# Altium schematic sheet optics.SchDoc
size A4; SheetNumber: 5; SheetTotal: 6
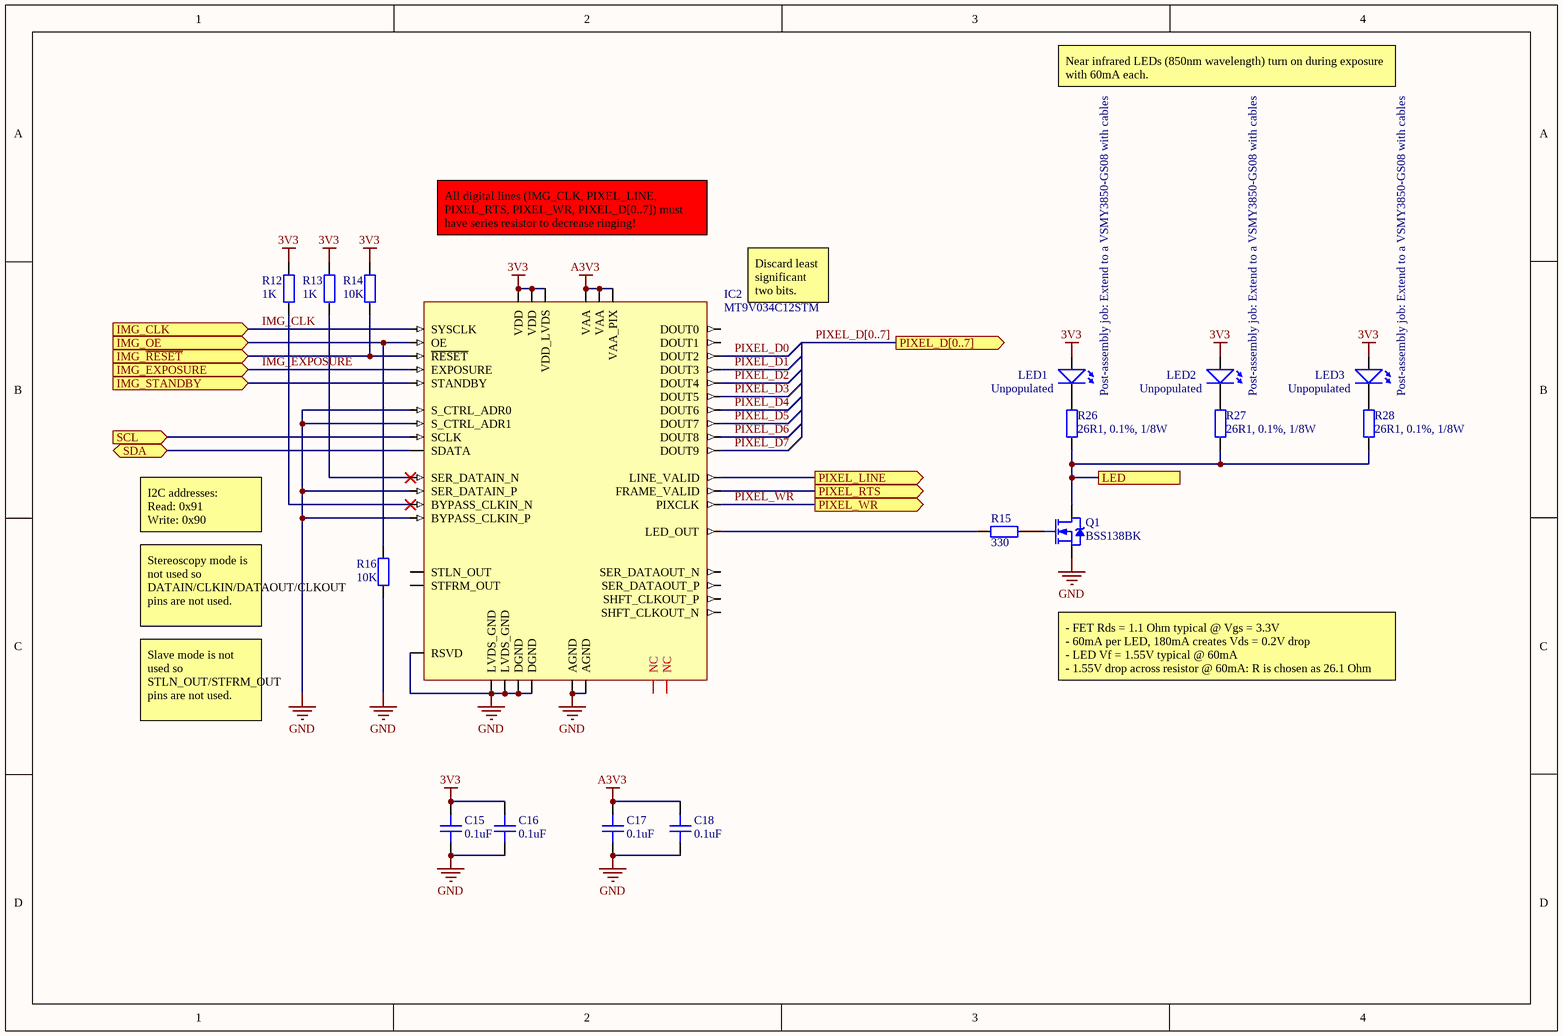
[diagram p0: optics.SchDoc]

## Parts
C15  0.1uF  [1608[0603]_M]
C16  0.1uF  [1608[0603]_M]
C17  0.1uF  [1608[0603]_M]
C18  0.1uF  [1608[0603]_M]
IC2  MT9V034C12STM  [CLCC-48_m]
LED1  Unpopulated  Post-assembly job: Extend to a VSMY3850-GS08 with cables  [CABLE-TERMINAL1x2]
LED2  Unpopulated  Post-assembly job: Extend to a VSMY3850-GS08 with cables  [CABLE-TERMINAL1x2]
LED3  Unpopulated  Post-assembly job: Extend to a VSMY3850-GS08 with cables  [CABLE-TERMINAL1x2]
Q1  BSS138BK  [SOT23-3_N]
R12  1K  [1608[0603]_M]
R13  1K  [1608[0603]_M]
R14  10K  [1608[0603]_M]
R15  330  [1608[0603]_M]
R16  10K  [1608[0603]_M]
R26  26R1, 0.1%, 1/8W  [2012[0805]_M]
R27  26R1, 0.1%, 1/8W  [2012[0805]_M]
R28  26R1, 0.1%, 1/8W  [2012[0805]_M]

## Ports
IMG_CLK (in), IMG_EXPOSURE (in), IMG_OE (in), IMG_STANDBY (in), IMG_~{RESET} (in), LED, PIXEL_D[0..7] (out), PIXEL_LINE (out), PIXEL_RTS (out), PIXEL_WR (out), SCL (in), SDA (bidir)

## Nets
3V3: C15.2 C16.2 IC2.1(VDD) IC2.6(VDD_LVDS) IC2.14(VDD) LED1.A LED2.A LED3.A R12.2 R13.2 R14.2
A3V3: C17.2 C18.2 IC2.35(VAA) IC2.39(VAA) IC2.40(VAA_PIX)
GND: C15.1 C16.1 C17.1 C18.1 IC2.7(LVDS_GND) IC2.9(BYPASS_CLKIN_P) IC2.11(SER_DATAIN_P) IC2.12(LVDS_GND) IC2.13(DGND) IC2.29(RSVD) IC2.30(S_CTRL_ADR0) IC2.31(S_CTRL_ADR1) IC2.34(AGND) IC2.38(AGND) IC2.48(DGND) Q1.S R16.1
IMG_CLK: IC2.47(SYSCLK) ; port IMG_CLK
IMG_EXPOSURE: IC2.23(EXPOSURE) ; port IMG_EXPOSURE
IMG_OE: IC2.28(OE) R16.2 ; port IMG_OE
IMG_~{RESET}: IC2.32(~{RESET}) R14.1 ; port IMG_~{RESET}
IMG_STANDBY: IC2.33(STANDBY) ; port IMG_STANDBY
LED: Q1.D R26.1 R27.1 R28.1 ; port LED
PIXEL_D0: IC2.43(DOUT2)
PIXEL_D1: IC2.42(DOUT3)
PIXEL_D2: IC2.41(DOUT4)
PIXEL_D3: IC2.15(DOUT5)
PIXEL_D4: IC2.16(DOUT6)
PIXEL_D5: IC2.17(DOUT7)
PIXEL_D6: IC2.18(DOUT8)
PIXEL_D7: IC2.19(DOUT9)
PIXEL_LINE: IC2.20(LINE_VALID) ; port PIXEL_LINE
PIXEL_RTS: IC2.21(FRAME_VALID) ; port PIXEL_RTS
PIXEL_WR: IC2.46(PIXCLK) ; port PIXEL_WR
SCL: IC2.25(SCLK) ; port SCL
SDA: IC2.24(SDATA) ; port SDA
NetIC2_8: IC2.8(BYPASS_CLKIN_N) R12.1
NetIC2_10: IC2.10(SER_DATAIN_N) R13.1
NetIC2_27: IC2.27(LED_OUT) R15.1
NetLED1_K: LED1.K R26.2
NetLED2_K: LED2.K R27.2
NetLED3_K: LED3.K R28.2
NetQ1_G: Q1.G R15.2

Not connected (* = marked no-connect by the designer): IC2 2(SHFT_CLKOUT_N) 3(SHFT_CLKOUT_P) 4(SER_DATAOUT_P) 5(SER_DATAOUT_N) 22(STLN_OUT) 26(STFRM_OUT) 36(NC) 37(NC) 44(DOUT1) 45(DOUT0)

## Buses and harness runs
bus PIXEL_D[0..7] = port PIXEL_D[0..7]

## Notes on the sheet
- Near infrared LEDs (850nm wavelength) turn on during exposure with 60mA each.
- All digital lines (IMG_CLK, PIXEL_LINE, PIXEL_RTS, PIXEL_WR, PIXEL_D[0..7]) must have series resistor to decrease ringing!
- (near IC2) Discard least significant two bits.
- I2C addresses:
  Read: 0x91
  Write: 0x90
- Stereoscopy mode is not used so DATAIN/CLKIN/DATAOUT/CLKOUT pins are not used.
- Slave mode is not used so STLN_OUT/STFRM_OUT pins are not used.
- - FET Rds = 1.1 Ohm typical @ Vgs = 3.3V
  - 60mA per LED, 180mA creates Vds = 0.2V drop
  - LED Vf = 1.55V typical @ 60mA
  - 1.55V drop across resistor @ 60mA: R is chosen as 26.1 Ohm

## Library data of the parts
C15-C18 = Capacitor: Generic Capacitor; Value: 0.1uF
IC2 = CMP-025-000000-1: 1/3" WVGA CMOS Image Sensor; Source: ImageSensor.SchLib; Design Item ID: MT9V034C12STM
LED1-LED3 = LED: Generic LED; pin to pad: A>1 K>2; Value: Unpopulated
Q1 = MOSFET-N_BodyDiode: N-channel MOSFET with body diode drawn; pin to pad: D>3 G>1 S>2
R12-R16 R26-R28 = Resistor: Generic Resistor
  R12 R13: Value: 1K
  R14 R16: Value: 10K
  R15: Value: 330
  R26-R28: Value: 26R1, 0.1%, 1/8W